# Altium schematic sheet Power Distribution - DC-DC.SchDoc: DC-DC Sense
size B; Organization: Midnight Sun Solar Rayce Car Team; Address1: University of Waterloo; Address2: 200 University Ave W; Address3: Waterloo, ON, Canada; Address4: N2L 3E9; Website: www.uwmidsun.com; ProjectName: ProjectName
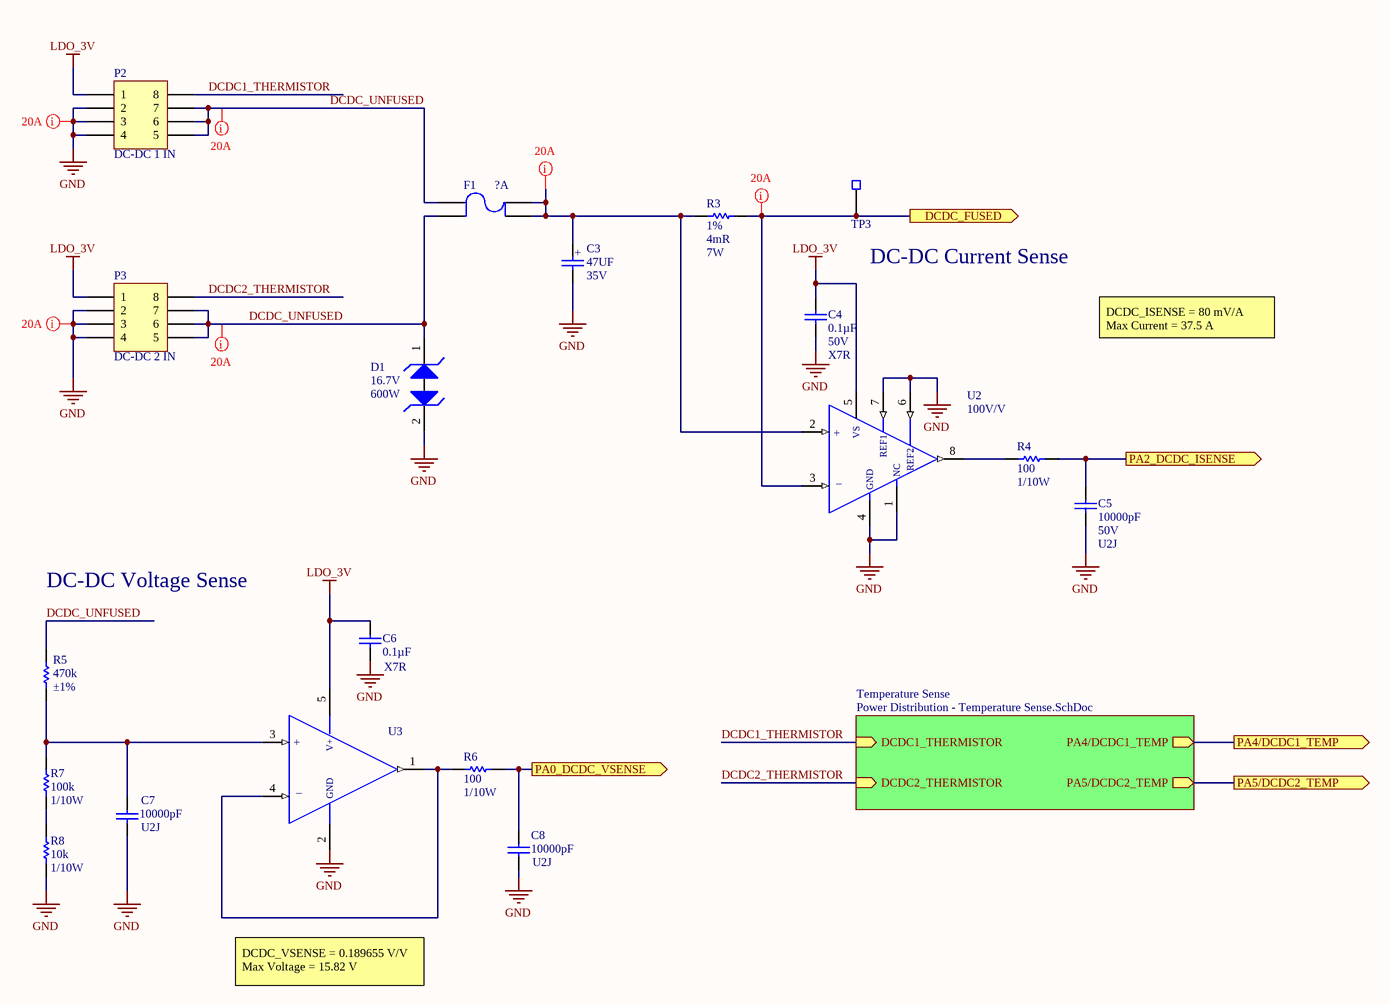
[diagram p0: Power Distribution - DC-DC.SchDoc]

## Parts
C3  47UF  Voltage Rating: 35V  [CAP ALUM 6.3MM RADIAL SMD]
C4  Capacitance: 0.1µF  Voltage: 50V  Temperature Coefficient: X7R  [CAP, 0603]  (hidden comment: CAP CER 0.1UF 50V 10% X7R 0603)
C5  Capacitance: 10000pF  Voltage: 50V  Temperature Coefficient: U2J  [CAP, 0603]  (hidden comment: CAP CER 10nF 50V 5% X7R 0603)
C6  Capacitance: 0.1µF  Temperature Coefficient: X7R  [CAP, 0603]  (hidden comment: CAP CER 0.1UF 50V 10% X7R 0603)
C7  Capacitance: 10000pF  Temperature Coefficient: U2J  [CAP, 0603]  (hidden comment: CAP CER 10nF 50V 5% X7R 0603)
C8  Capacitance: 10000pF  Temperature Coefficient: U2J  [CAP, 0603]  (hidden comment: CAP CER 10nF 50V 5% X7R 0603)
D1  Voltage - Breakdown (Min): 16.7V  Power - Peak Pulse: 600W  [DO-214AA Diode]  (hidden comment: DIODE TVS 15VWM 24.4VC DO-214AA (SMB))
F1  ?A  [FUSE ATO/ATC FUSE HOLDER]
P2  CONN 8POS ULTRA-FIT 0.138"  [CONN, 8POS ULTRA-FIT]  (value not drawn)
P3  CONN 8POS ULTRA-FIT 0.138"  [CONN, 8POS ULTRA-FIT]  (value not drawn)
R3  Tolerance: 1%  Resistance: 4mR  Max Power Dissipation: 7W  [RES 5931]  (hidden comment: RES 0.004 OHM 1% 7W 5931)
R4  Resistance: 100  Power: 1/10W  [RES, 0603]  (hidden comment: RES 100 OHM 1% 1/10W 0603)
R5  Resistance: 470k  Tolerance: ±1%  [RES, 0603]  (hidden comment: RES 470K OHM 1% 1/4W 0603)
R6  Resistance: 100  Power: 1/10W  [RES, 0603]  (hidden comment: RES 100 OHM 1% 1/10W 0603)
R7  Resistance: 100k  Power: 1/10W  [RES, 0603]  (hidden comment: RES 100K OHM 5% 1/8W 0603)
R8  Resistance: 10k  Power: 1/10W  [RES, 0603]  (hidden comment: RES 10K OHM 1% 1/10W 0603)
TP3  Test Point 0603 SMD  [TEST POINT 0603 SMD]  (value not drawn)
U2  100V/V  [IC CURRENT AMPLIFIER INA240 TSSOP-8]
U3  IC OP AMP GEN PURPOSE RR 10MHZ SOT-23-5  [IC OP AMP GP RR 10MHZ SOT-23-5]  (value not drawn)

## Sub-sheets
Temperature Sense = Power Distribution - Temperature Sense.SchDoc: DCDC1_THERMISTOR (in), DCDC2_THERMISTOR (in), PA4/DCDC1_TEMP (out), PA5/DCDC2_TEMP (out)

## Ports
DCDC_FUSED (out), PA0_DCDC_VSENSE (out), PA2_DCDC_ISENSE (out), PA4/DCDC1_TEMP (out), PA5/DCDC2_TEMP (out)

## Nets
GND: C3.2 C4.2 C5.2 C6.2 C7.2 C8.2 D1.2(Cathode2) P2.2 P2.3 P2.4 P3.2 P3.3 P3.4 R8.2 U2.1(NC) U2.4(GND) U2.6(REF2) U2.7(REF1) U3.2(VSS)
LDO_3V: C4.1 C6.1 P2.1 P3.1 U2.5(VS) U3.5(VDD)
DCDC1_THERMISTOR: P2.8 ; sheet Temperature Sense/DCDC1_THERMISTOR
DCDC2_THERMISTOR: P3.8 ; sheet Temperature Sense/DCDC2_THERMISTOR
DCDC_FUSED: R3.2 TP3.1 U2.3(-IN) ; port DCDC_FUSED
DCDC_UNFUSED: D1.1(Cathode1) F1.1 F1.3 P2.5 P2.6 P2.7 P3.5 P3.6 P3.7 R5.1
PA0_DCDC_VSENSE: C8.1 R6.2 ; port PA0_DCDC_VSENSE
PA2_DCDC_ISENSE: C5.1 R4.2 ; port PA2_DCDC_ISENSE
PA4/DCDC1_TEMP: port PA4/DCDC1_TEMP, sheet Temperature Sense/PA4/DCDC1_TEMP
PA5/DCDC2_TEMP: port PA5/DCDC2_TEMP, sheet Temperature Sense/PA5/DCDC2_TEMP
NetC3_1: C3.1 F1.2 F1.4 R3.1 U2.2(+IN)
NetC7_1: C7.1 R5.2 R7.1 U3.3(+IN)
NetR4_1: R4.1 U2.8(OUTPUT)
NetR6_1: R6.1 U3.1(OUTPUT) U3.4(-IN)
NetR7_2: R7.2 R8.1

## Layout directives
net class HighCurrent; rule Power Plane Connect Style [Style - Direct Connect]; rule Polygon Connect Style [Style - Direct Connect]: DCDC_FUSED, DCDC_UNFUSED, GND, NetC3_1

## Notes on the sheet
- (near P2) DC-DC 1 IN
- DC-DC Current Sense
- (near P3) DC-DC 2 IN
- DCDC_ISENSE = 80 mV/A
  Max Current = 37.5 A
- DC-DC Voltage Sense
- DCDC_VSENSE = 0.189655 V/V
  Max Voltage = 15.82 V
- PROJECT
- DOCUMENT
- DRAWN BY
- LAST MODIFIED
- PART NUMBER
- REVISION
- SHEET
- VARIANT
- OF
- Engineering 5 - 1002
  University of Waterloo
  (519) 888-4567 x32978
  hardware@uwmidsun.com
- (in symbol CAP ALUM 47UF 20% 35V SMD) +
- (in symbol IC CURRENT AMPLIFIER INA240 8-TSSOP) +; _
- (in symbol IC OP AMP GEN PURPOSE RR 10MHZ SOT-23-5) V+; +; GND; _

## Library data of the parts
C3 = CAP ALUM 47UF 20% 35V SMD: 47µF 35V Aluminum Electrolytic Capacitors Radial, Can - SMD 1000 Hrs @ 85°C; Manufacturer: Panasonic; Manufacturer Part Number: EEE-1VA470WP; Tolerance: 20%; Ripple Current: 70mA; Life (Hours): 1000Hour; Supplier 1: Digi-Key; Stock 1: 2820; Pricing 1: 1=0.38, 10=0.263, 100=0.1579, 500=0.11846 (USD); Mount: Surface Mount,PCB; Case/Package: Radial; Contact Plating: Tin; Min Operating Temperature: -40°C; Max Operating Temperature: 85°C; Capacitance: 47uF; Voltage Rating (DC): 35V; Packaging: Tape and Reel; Package Quantity: 1; Ripple Current (AC): 70mA; Termination: SMD/SMT; Diameter: 6.3mm; Length: 5.5mm; Height: 5.4mm; Height - Seated (Max): 0.213inch; Radiation Hardening: No; REACH SVHC: Unknown; Lead Free: Lead Free; ComponentLink1URL: https://datasheet.ciiva.com/2983/aba0000ce2-2983926.pdf; ComponentLink1Description: https://datasheet.ciiva.com/2983/aba0000ce2-2983926.pdf; ComponentLink2URL: https://datasheet.ciiva.com/2983/aba0000ce2-2983927.pdf; ComponentLink2Description: https://datasheet.ciiva.com/2983/aba0000ce2-2983927.pdf; ComponentLink3URL: https://datasheet.ciiva.com/14598/70255710-14598937.pdf; ComponentLink3Description: https://datasheet.ciiva.com/14598/70255710-14598937.pdf; ComponentLink4URL: https://datasheet.ciiva.com/15165/getdatasheetpartid-86239-15165868.pdf; ComponentLink4Description: https://datasheet.ciiva.com/15165/getdatasheetpartid-86239-15165868.pdf; ComponentLink5URL: https://datasheet.ciiva.com/16507/aba0000ce2-16507965.pdf; ComponentLink5Description: https://datasheet.ciiva.com/16507/aba0000ce2-16507965.pdf; ComponentLink6URL: https://datasheet.ciiva.com/30206/11aba0000ce2-30206253.pdf; ComponentLink6Description: https://datasheet.ciiva.com/30206/11aba0000ce2-30206253.pdf; Supplier Part Number 1: PCE3961CT-ND
C4 C6 = CAP CER 0.1UF 50V 10% X7R 0603: 0.10µF ±10% 50V Ceramic Capacitor X7R 0603 (1608 Metric); Manufacturer 1: AVX Corporation; Manufacturer Part Number 1: 06035C104KAT2A; Supplier 1: Digi-Key; Supplier Part Number 1: 478-5052-1-ND; Packaging: Cut Tape (CT); Part Status: Active; Operating Temperature: -55°C ~ 125°C; Ratings: -; Mounting Type: Surface Mount, MLCC; Package / Case: 0603 (1608 Metric); Size / Dimension: 0.063" L x 0.032" W (1.60mm x 0.81mm); Height - Seated (Max): -; Thickness (Max): 0.035" (0.90mm); Lead Spacing: -; Lead Style: -; ComponentLink1URL: http://datasheets.avx.com/X7RDielectric.pdf; ComponentLink1Description: http://datasheets.avx.com/X7RDielectric.pdf; Tolerance: ±10%
  C6: Voltage: 50V
C5 C7 C8 = CAP CER 10nF 50V 5% X7R 0603: 10000pF ±5% 50V Ceramic Capacitor U2J 0603 (1608 Metric); Manufacturer 1: KEMET; Manufacturer Part Number 1: C0603C103J5JAC7867; Supplier 1: Digi-Key; Supplier Part Number 1: 399-13384-1-ND; Packaging: Cut Tape (CT); Part Status: Active; Operating Temperature: -55°C ~ 125°C; Ratings: -; Failure Rate: -; Mounting Type: Surface Mount, MLCC; Package / Case: 0603 (1608 Metric); Size / Dimension: 0.063" L x 0.032" W (1.60mm x 0.80mm); Height - Seated (Max): -; Thickness (Max): 0.034" (0.87mm); Lead Spacing: -; Lead Style: -; ComponentLink1URL: http://www.kemet.com/docfinder?Partnumber=C0603C103J5JAC7867; ComponentLink1Description: http://www.kemet.com/docfinder?Partnumber=C0603C103J5JAC7867; Tolerance: ±5%
  C7 C8: Voltage: 50V
D1 = DIODE TVS 15VWM 24.4VC DO-214AA (SMB): TVS DIODE 15VWM 24.4VC SMB; Manufacturer 1: Fairchild/ON Semiconductor; Manufacturer Part Number 1: SMBJ15CA; Type: Zener; Voltage - Reverse Standoff (Typ): 15V; Voltage - Clamping (Max) @ Ipp: 24.4V; Current - Peak Pulse (10/1000µs): 24.6A; Power Line Protection: No; Supplier 1: Digi-Key; Supplier Part Number 1: SMBJ15CAFSCT-ND; RoHS: RoHS Compliant; Description 1: TVS DIODE 15VWM 24.4VC SMB; Category: Circuit Protection; Stock 1: 24965; Pricing 1: 1=0.54, 10=0.444, 100=0.3027, 500=0.22704, 1000=0.17028 (CAD); Packaging: Cut Tape (CT); Part Status: Active; Applications: General Purpose; Capacitance @ Frequency: -; Operating Temperature: -55°C ~ 150°C (TJ); Mounting Type: Surface Mount; Package / Case: DO-214AA, SMB; Supplier Device Package: DO-214AA (SMB); ComponentLink1URL: https://www.fairchildsemi.com/datasheets/SM/SMBJ10CA.pdf; ComponentLink1Description: https://www.fairchildsemi.com/datasheets/SM/SMBJ10CA.pdf
F1 = FUSE ATO FUSE HOLDER: Fuse Block 30A 500V 1 Circuit Blade PCB; Manufacturer 1: Keystone Electronics; Manufacturer Part Number 1: 3557-2; Description 1: FUSE BLOCK BLADE 500V 30A PCB; For Use With/Related Products: ATC, ATO 257, MINI 897; Fuse Size: 0.43" L x 0.15" W x 0.64" H (10.92mm x 3.81mm x 16.25mm); Number of Circuits: 1; Supplier 1: Digi-Key; Supplier Part Number 1: 36-3557-2-ND; RoHS: RoHS Compliant; Category: Circuit Protection; Stock 1: 48838; Pricing 1: 1=1.66, 10=1.442, 50=1.3008, 100=1.2441, 250=1.13096, 500=1.01784, 1000=1.0126, 2500=0.84861, 5000=0.81519 (CAD); Part Status: Active; Fuseholder Type: Block; Fuse Type: Blade; Voltage: 500V; Current Rating: 30A; Mounting Type: PCB; Orientation: Vertical; Termination Style: PC Pin; Contact Material: Brass; Contact Finish: Tin Nickel; ComponentLink1URL: http://www.keyelco.com/product-pdf.cfm?p=296; ComponentLink1Description: http://www.keyelco.com/product-pdf.cfm?p=296
P2 P3 = CONN 8POS ULTRA-FIT 0.138": 8 Positions Header Connector 0.138" (3.50mm) Through Hole Tin; Manufacturer: Molex, LLC; Manufacturer Part Number: 1722991108; Style: Board to Cable/Wire; Shrouding: Shrouded - 4 Wall; Number of Positions: 8; Number of Positions Loaded: All; Row Spacing - Mating: 0.181" (4.60mm); Contact Length - Post: 0.126" (3.20mm); Material Flammability Rating: UL94 V-0; Voltage Rating: 400V; Mated Stacking Heights: 26.99mm; Supplier 1: Digi-Key; RoHS: RoHS Compliant; Category: Connectors, Interconnects; Stock 1: 60; Pricing 1: 1=2.12, 10=1.923, 50=1.7262, 100=1.6478, 250=1.49084, 500=1.37314, 1000=1.17697, 2500=1.0985, 5000=1.04358 (CAD); Packaging: Tray; Part Status: Active; Connector Type: Header; Contact Type: Male Pin; Pitch - Mating: 0.138" (3.50mm); Number of Rows: 2; Mounting Type: Through Hole; Termination: Solder; Fastening Type: Latch Holder; Contact Length - Mating: -; Overall Contact Length: -; Insulation Height: 0.465" (11.80mm); Contact Shape: Square; Contact Finish - Mating: Tin; Contact Finish Thickness - Mating: 60µin (1.52µm); Contact Finish - Post: Tin; Contact Material: Copper Alloy; Insulation Material: Liquid Crystal Polymer (LCP); Features: Board Guide, Solder Retention; Operating Temperature: -40°C ~ 105°C; Ingress Protection: -; Insulation Color: Black; Current Rating: -; Contact Finish Thickness - Post: 60µin (1.52µm); Applications: Automotive, General Purpose, Industrial, Lighting, Medical, Military, Telecommunications; ComponentLink1URL: http://www.molex.com/pdm_docs/sd/1722991108_sd.pdf; ComponentLink1Description: http://www.molex.com/pdm_docs/sd/1722991108_sd.pdf; Supplier Part Number 1: WM11779-ND
R3 = RES 0.004 OHM 1% 7W 5931: 4 mOhms ±1% 7W Chip Resistor Nonstandard Automotive AEC-Q200, Current Sense, Moisture Resistant Metal Element; Manufacturer 1: Yageo; Manufacturer Part Number 1: PU5931FKMP70R004L; Description 1: RES SMD 0.004 OHM 1% 7W 5931; Temperature Coefficient: 75ppm/°C; Supplier 1: Digi-Key; Supplier Part Number 1: YAG4096CT-ND; Stock 1: 1097; Pricing 1: 1=2.06, 10=1.823, 25=1.6904, 50=1.5912, 100=1.3922, 250=1.19336, 500=0.99446 (USD); Case/Package: 5931; Min Operating Temperature: -65°C; Max Operating Temperature: 170°C; Packaging: Cut Tape; Composition: Metal Element; Number of Terminations: 2; Length: 0.591inch; Height: 0.015inch; Width: 0.305inch; ComponentLink1URL: http://www.yageo.com/documents/recent/PYu-PU_51_RoHS_L_3.pdf; ComponentLink1Description: http://www.yageo.com/documents/recent/PYu-PU_51_RoHS_L_3.pdf
R4 R6 = RES 100 OHM 1% 1/10W 0603: 100 Ohm ±1% 0.1W, 1/10W Chip Resistor 0603 (1608 Metric) Moisture Resistant Thick Film; Manufacturer 1: Yageo; Manufacturer Part Number 1: RC0603FR-07100RL; Temperature Coefficient: ±100ppm/°C; Supplier 1: Digi-Key; Supplier Part Number 1: 311-100HRCT-ND; Packaging: Cut Tape (CT); Part Status: Active; Composition: Thick Film; Operating Temperature: -55°C ~ 155°C; Package / Case: 0603 (1608 Metric); Supplier Device Package: 0603; Size / Dimension: 0.063" L x 0.031" W (1.60mm x 0.80mm); Height - Seated (Max): 0.022" (0.55mm); Failure Rate: -; ComponentLink1URL: http://www.yageo.com/documents/recent/PYu-RC_Group_51_RoHS_L_7.pdf; ComponentLink1Description: http://www.yageo.com/documents/recent/PYu-RC_Group_51_RoHS_L_7.pdf; Tolerance: ±1%
R5 = RES 470K OHM 1% 1/4W 0603: RES SMD 470K OHM 1% 1/4W 0603; Manufacturer 1: Panasonic Electronic Components; Manufacturer Part Number 1: ERJ-PA3F4703V; Temperature Coefficient: ±100ppm/°C; Supplier 1: Digi-Key; Supplier Part Number 1: P470KBYCT-ND; Packaging: Cut Tape (CT); Part Status: Active; Composition: Thick Film; Operating Temperature: -55°C ~ 155°C; Package / Case: 0603 (1608 Metric); Supplier Device Package: 0603; Size / Dimension: 0.063" L x 0.031" W (1.60mm x 0.80mm); Height - Seated (Max): 0.022" (0.55mm); Failure Rate: -; ComponentLink1URL: https://industrial.panasonic.com/cdbs/www-data/pdf/RDO0000/AOA0000C291.pdf; ComponentLink1Description: https://industrial.panasonic.com/cdbs/www-data/pdf/RDO0000/AOA0000C291.pdf
R7 = RES 100K OHM 5% 1/8W 0603: RES SMD 100K OHM 5% 1/10W 0603; Manufacturer 1: Yageo; Manufacturer Part Number 1: RC0603JR-07100KL; Temperature Coefficient: ±100ppm/°C; Supplier 1: Digi-Key; Supplier Part Number 1: 311-100KGRCT-ND; Packaging: Cut Tape (CT); Part Status: Active; Composition: Thick Film; Operating Temperature: -55°C ~ 155°C; Package / Case: 0603 (1608 Metric); Supplier Device Package: 0603; Size / Dimension: 0.063" L x 0.031" W (1.60mm x 0.80mm); Height - Seated (Max): 0.022" (0.55mm); Failure Rate: -; ComponentLink1URL: http://www.yageo.com/documents/recent/PYu-RC_Group_51_RoHS_L_7.pdf; ComponentLink1Description: http://www.yageo.com/documents/recent/PYu-RC_Group_51_RoHS_L_7.pdf; Tolerance: ±5%
R8 = RES 10K OHM 1% 1/10W 0603: RES SMD 10K OHM 1% 1/10W 0603; Manufacturer 1: Yageo; Manufacturer Part Number 1: RC0603FR-0710KL; Temperature Coefficient: ±100ppm/°C; Supplier 1: Digi-Key; Supplier Part Number 1: 311-10.0KHRCT-ND; Packaging: Cut Tape (CT); Part Status: Active; Composition: Thick Film; Operating Temperature: -55°C ~ 155°C; Package / Case: 0603 (1608 Metric); Supplier Device Package: 0603; Size / Dimension: 0.063" L x 0.031" W (1.60mm x 0.80mm); Height - Seated (Max): 0.022" (0.55mm); Failure Rate: -; ComponentLink1URL: http://www.yageo.com/documents/recent/PYu-RC_Group_51_RoHS_L_7.pdf; ComponentLink1Description: http://www.yageo.com/documents/recent/PYu-RC_Group_51_RoHS_L_7.pdf; Tolerance: ±1%
TP3 = Test Point 0603 SMD: Manufacturer 1: TE Connectivity; Manufacturer Part Number 1: 1625854-3; Description 1: Thick Film Resistors - SMD 2000; Resistance: 0mR; Supplier 1: Digi-Key; Supplier Part Number 1: A106145CT-ND; Stock 1: 212628; Pricing 1: 1=0.22, 10=0.211, 25=0.18, 50=0.1574, 100=0.1462, 250=0.12932, 500=0.12368, 1000=0.1012 (USD); Mount: Surface Mount; Case/Package: 0603; Colour: Natural; Case Code (Imperial): 0603; Case Code (Metric): 1608; Min Operating Temperature: -55°C; Max Operating Temperature: 125°C; Packaging: Tape and Reel; Termination: SMD/SMT; Package Quantity: 2000; Military Standard: Not; Length: 1.6mm; Height: 1.15mm; Width: 0.8mm; Depth: 0.8mm; Radiation Hardening: No; ComponentLink1URL: https://datasheet.ciiva.com/30100/1773266-a-30100967.pdf; ComponentLink1Description: https://datasheet.ciiva.com/30100/1773266-a-30100967.pdf; ComponentLink2URL: https://datasheet.ciiva.com/8914/eng-ds-1773266-a-8914634.pdf; ComponentLink2Description: https://datasheet.ciiva.com/8914/eng-ds-1773266-a-8914634.pdf; ComponentLink3URL: https://datasheet.ciiva.com/6439/eng-ds-1773266-a-6439163.pdf; ComponentLink3Description: https://datasheet.ciiva.com/6439/eng-ds-1773266-a-6439163.pdf; ComponentLink4URL: https://datasheet.ciiva.com/6439/eng-ds-1773266-a-6439164.pdf; ComponentLink4Description: https://datasheet.ciiva.com/6439/eng-ds-1773266-a-6439164.pdf; ComponentLink5URL: https://datasheet.ciiva.com/6439/eng-ds-1773266-a-6439165.pdf; ComponentLink5Description: https://datasheet.ciiva.com/6439/eng-ds-1773266-a-6439165.pdf
U2 = IC CURRENT AMPLIFIER INA240 8-TSSOP: Current Sense Amplifier 1 Circuit 8-TSSOP; Manufacturer 1: Texas Instruments; Manufacturer Part Number 1: INA240A3PWR; Description 1: IC AMP CURRENT SENSE 8-TSSOP; Slew Rate: 2 V/µs; Current - Supply: 1.8mA; Voltage - Supply, Single/Dual (±): 2.7 V ~ 5.5 V; Supplier 1: Digi-Key; Supplier Part Number 1: 296-45090-1-ND; RoHS: RoHS Compliant; Category: Integrated Circuits (ICs); Stock 1: 1286; Pricing 1: 1=3.79, 10=3.397, 100=2.7311, 500=2.24388, 1000=1.85921 (CAD); Packaging: Cut Tape (CT); Part Status: Active; Amplifier Type: Current Sense; Output Type: -; Operating Temperature: -40°C ~ 125°C; Mounting Type: Surface Mount; Package / Case: 8-TSSOP (0.173", 4.40mm Width); Supplier Device Package: 8-TSSOP; ComponentLink1URL: http://www.ti.com/lit/ds/symlink/ina240.pdf; ComponentLink1Description: http://www.ti.com/lit/ds/symlink/ina240.pdf
U3 = IC OP AMP GEN PURPOSE RR 10MHZ SOT-23-5: General Purpose Amplifier 1 Circuit Rail-to-Rail SOT-23-5; Manufacturer 1: Texas Instruments; Manufacturer Part Number 1: TLV316QDBVRQ1; Description 1: IC OP AMP GP RR 10MHZ 5-SOT-23; Number of Circuits: 1; Slew Rate: 6 V/µs; Current - Supply: 400µA; Current - Output / Channel: 50mA; Voltage - Supply, Single/Dual (±): 1.8 V ~ 5.5 V, ±0.9 V ~ 2.75 V; Supplier 1: Digi-Key; Supplier Part Number 1: 296-45323-1-ND; RoHS: RoHS Compliant; Category: Integrated Circuits (ICs); Stock 1: 1747; Pricing 1: 1=1.33, 10=1.185, 100=0.9234, 500=0.76276, 1000=0.60218 (CAD); Packaging: Cut Tape (CT); Part Status: Active; Amplifier Type: General Purpose; Output Type: Rail-to-Rail; -3db Bandwidth: -; Operating Temperature: -40°C ~ 125°C; Mounting Type: Surface Mount; Package / Case: SC-74A, SOT-753; Supplier Device Package: SOT-23-5; ComponentLink1URL: http://www.ti.com/lit/ds/symlink/tlv316-q1.pdf; ComponentLink1Description: http://www.ti.com/lit/ds/symlink/tlv316-q1.pdf